# EAGLE design STM32-G0-Dip-Module (EAGLE 9.6.2)
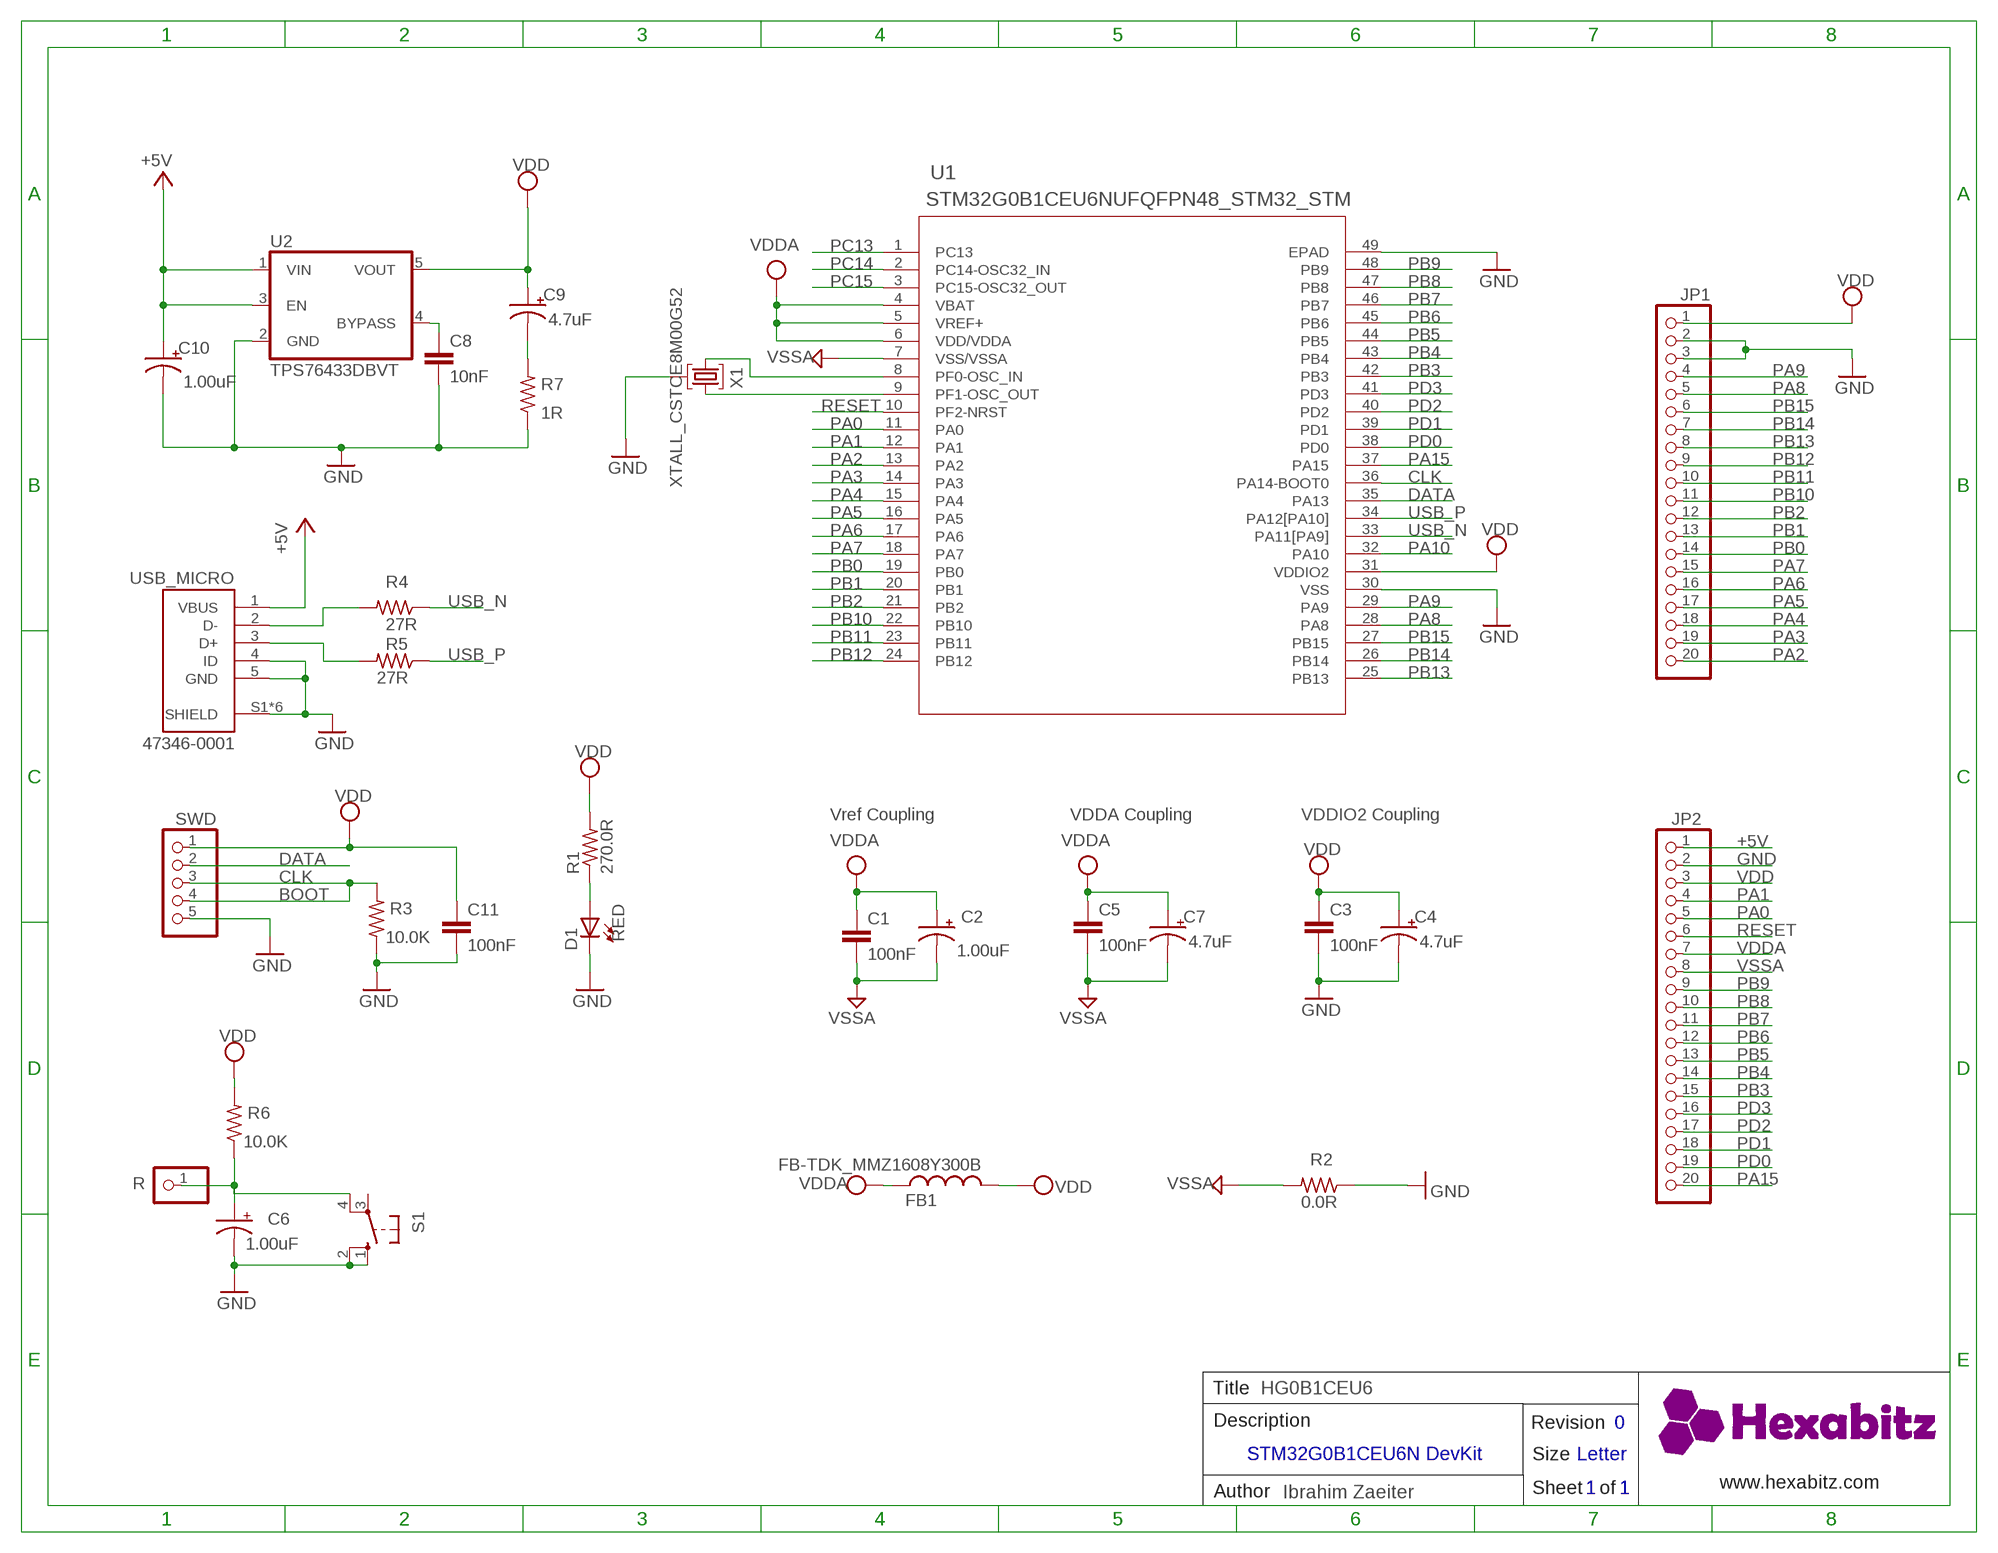
[diagram p0: schematic, sheet 1]

## Parts
C1  100nF  C-0603  [C-0603]
C2  1.00uF  C-0805-POL  [C-0805-POL]
C3  100nF  C-0603  [C-0603]
C4  4.7uF  C-0805-POL  [C-0805-POL]
C5  100nF  C-0603  [C-0603]
C6  1.00uF  C-0805-POL  [C-0805-POL]
C7  4.7uF  C-0805-POL  [C-0805-POL]
C8  10nF  C-0603  [C-0603]
C9  4.7uF  C-0805-POL  [C-0805-POL]
C10  1.00uF  C-0805-POL  [C-0805-POL]
C11  100nF  C-0603  [C-0603]
D1  RED  VLMS1300-GS08  [VLMS1300-GS08]
FB1  FB-TDK_MMZ1608Y300B  [FB-TDK_MMZ1608Y300B]
JP1  PINHD-1X20  [1X20]
JP2  PINHD-1X20  [1X20]
R  PINHD-1X1  [1X01]
R1  270.0R  R-0603  [R-0603]
R2  0.0R  R-0603  [R-0603]
R3  10.0K  R-0603  [R-0603]
R4  27R  R-0603  [R-0603]
R5  27R  R-0603  [R-0603]
R6  10.0K  R-0603  [R-0603]
R7  1R  R-0603  [R-0603]
S1  10-XX  [B3F-10XX]
SWD  PINHD-1X5/90  [1X05/90]
U1  STM32G0B1CEU6NUFQFPN48_STM32_STM  [UFQFPN48_STM32_STM]
U2  TPS76433DBVT  [SOT25]
USB_MICRO  47346-0001  [MOLEX_47346-0001]
X1  XTALL_CSTCE8M00G52  [XTALL_CSTCE8M00G52]

## Nets
+5V: C10.1(+) JP2.1 U2.1(VIN) U2.3(EN) USB_MICRO.1(VBUS)
AGND: C1.2 C2.2(-) C5.2 C7.2(-) JP2.8 R2.2 U1.7(VSS/VSSA) ; supply symbol labelled VSSA
CLK: R3.2 SWD.3 SWD.4 U1.36(PA14-BOOT0)
CRYSTAL_N: U1.8(PF0-OSC_IN) X1.P$1
CRYSTAL_P: U1.9(PF1-OSC_OUT) X1.P$3
D_N [diff pairs]: R4.2 USB_MICRO.2(D-)
D_P [diff pairs]: R5.2 USB_MICRO.3(D+)
DATA: SWD.2 U1.35(PA13)
GND: C3.2 C4.2(-) C6.2(-) C8.2 C10.2(-) C11.2 D1.C JP1.2 JP1.3 JP2.2 R2.1 R3.1 R7.1 S1.1(S) S1.2(S1) SWD.5 U1.30(VSS) U1.49(EPAD) U2.2(GND) USB_MICRO.4(ID) USB_MICRO.5(GND) USB_MICRO.S1(SHIELD) USB_MICRO.S2(SHIELD) USB_MICRO.S3(SHIELD) USB_MICRO.S4(SHIELD) USB_MICRO.S5(SHIELD) USB_MICRO.S6(SHIELD) X1.P$2
N$1: C9.2(-) R7.2
N$4: D1.A R1.1
N$9: C8.1 U2.4(BYPASS)
PA0: JP2.5 U1.11(PA0)
PA1: JP2.4 U1.12(PA1)
PA2: JP1.20 U1.13(PA2)
PA3: JP1.19 U1.14(PA3)
PA4: JP1.18 U1.15(PA4)
PA5: JP1.17 U1.16(PA5)
PA6: JP1.16 U1.17(PA6)
PA7: JP1.15 U1.18(PA7)
PA8: JP1.5 U1.28(PA8)
PA9: JP1.4 U1.29(PA9)
PA10: U1.32(PA10)
PA15: JP2.20 U1.37(PA15)
PB0: JP1.14 U1.19(PB0)
PB1: JP1.13 U1.20(PB1)
PB2: JP1.12 U1.21(PB2)
PB3: JP2.15 U1.42(PB3)
PB4: JP2.14 U1.43(PB4)
PB5: JP2.13 U1.44(PB5)
PB6: JP2.12 U1.45(PB6)
PB7: JP2.11 U1.46(PB7)
PB8: JP2.10 U1.47(PB8)
PB9: JP2.9 U1.48(PB9)
PB10: JP1.11 U1.22(PB10)
PB11: JP1.10 U1.23(PB11)
PB12: JP1.9 U1.24(PB12)
PB13: JP1.8 U1.25(PB13)
PB14: JP1.7 U1.26(PB14)
PB15: JP1.6 U1.27(PB15)
PC13: U1.1(PC13)
PC14: U1.2(PC14-OSC32_IN)
PC15: U1.3(PC15-OSC32_OUT)
PD0: JP2.19 U1.38(PD0)
PD1: JP2.18 U1.39(PD1)
PD2: JP2.17 U1.40(PD2)
PD3: JP2.16 U1.41(PD3)
RESET: C6.1(+) JP2.6 R6.1 R.1 S1.4(P1) U1.10(PF2-NRST)
USB_N [diff pairs]: R4.1 U1.33(PA11[PA9])
USB_P [diff pairs]: R5.1 U1.34(PA12[PA10])
VDD: C3.1 C4.1(+) C9.1(+) C11.1 FB1.2 JP1.1 JP2.3 R1.2 R6.2 SWD.1 U1.31(VDDIO2) U2.5(VOUT)
VDDA: C1.1 C2.1(+) C5.1 C7.1(+) FB1.1 JP2.7 U1.4(VBAT) U1.5(VREF+) U1.6(VDD/VDDA)
Unconnected: S1.3(P)

## Notes on the sheet
- C:/Users/Admin/Desktop/logodraft.bmp
- Vref Coupling | VDDA Coupling | VDDIO2 Coupling
- BOOT
- VSSA
- Title | HG0B1CEU6
- Description | Revision | 0
- STM32G0B1CEU6N DevKit
- Size | Letter
- www.hexabitz.com
- Author | Ibrahim Zaeiter | Sheet   of | 1 | 1

## Library data of the parts
C1 C3 C11 = HEXABITZ_RCLS:C-0603: CAP CER 10% X7R 0603; CAPACITANCE: 100nF; MFN: KEMET; MPN: C0603C104K8RACTU; OCTOPART_URL: https://octopart.com/c0603c104k8ractu-kemet-145075?r=sp&s=9bS9ASSwSEqMCE9KBEQZ0g; TOLERANCE: 10%; VOLTAGE_RATING: 10V
C2 C6 C10 = HEXABITZ_RCLS:C-0805-POL: Cap Tant Solid SMD 2012; CAPACITANCE: 1.00uF; MFN: Yageo; MPN: CC0805KKX7R7BB105; OCTOPART_URL: https://octopart.com/cc0805kkx7r7bb105-yageo-8376555?r=sp&s=YKl1wwtkROau_X5nniH2ig; TOLERANCE: 10%; VOLTAGE_RATING: 16V
C4 C7 C9 = HEXABITZ_RCLS:C-0805-POL: Cap Tant Solid SMD 2012; CAPACITANCE: 4.7uF; MFN: Murata; MPN: GRM21BC81E475KA12L; OCTOPART_URL: https://octopart.com/grm21bc81e475ka12l-murata-10331911?r=sp&s=RY3qZSD8T6mG6TC9CHI5qQ; TOLERANCE: 10%; VOLTAGE_RATING: 25V
C5 C8 = HEXABITZ_RCLS:C-0603: CAP CER 10% X7R 0603; CAPACITANCE: 100nF; MFN: KEMET; MPN: C0603C104K8RACTU; OCTOPART_URL: https://octopart.com/c0603c104k8ractu-kemet-145075?r=sp&s=9bS9ASSwSEqMCE9KBEQZ0g; TOLERANCE: 10%; VOLTAGE_RATING: 10
D1 = HEXABITZ_USER_INTERFACE_PARTS:VLMS1300-GS08: Red 0603 130° Clear 54 mcd 2 V Surface Mount ChipLED ; Octopart Url : http://octopart.com/vlms1300-gs08-vishay-21709201; MFN: Vishay; MPN: VLMS1300-GS08; OCTOPART_URL: https://octopart.com/vlms1300-gs08-vishay-21709201?r=sp&s=_gcP4_q8T1SC6PJQPTQ9yA
FB1 = HEXABITZ_RCLS:FB-TDK_MMZ1608Y300B: Ferrite Beads Multi-Layer 30Ohm 25% 100MHz 1.5A 50mOhm DCR 0603; MFN: TDK; MPN: MMZ1608Y300B; OCTOPART_URL: https://octopart.com/mmz1608y300b-tdk-368280?r=sp&s=cd9_2ZEqQ9q9UNBuQgHAiA
JP1 JP2 = pinhead:PINHD-1X20: PIN HEADER
R = HEXABITZ_USER_INTERFACE_PARTS:PINHD-1X1: PIN HEADER; MFN: TE Connectivity; MPN: 87227-1; OCTOPART_URL: https://octopart.com/87227-1-te+connectivity-39512052?r=sp
R1 = HEXABITZ_RCLS:R-0603: Thick Film Resistors - SMD 0603; MFN: Yageo; MPN: RC0603FR-07270RL; OCTOPART_URL: https://octopart.com/search?q=RC0603FR-07270RL&start=0; RESISTANCE: 270.0 Ohm; TOLERANCE: 1%
R2 = HEXABITZ_RCLS:R-0603: Thick Film Resistors - SMD 0603; MFN: Yageo; MPN: RC0603JR-070RL; OCTOPART_URL: https://octopart.com/rc0603jr-070rl-yageo-1241539?r=sp&s=X2NteqRjRNWrnx42Y0aliA; RESISTANCE: 0.0 Ohm
R3-R7 = HEXABITZ_RCLS:R-0603: Thick Film Resistors - SMD 0603; MFN: Yageo; MPN: RC0603JR-0710KL; OCTOPART_URL: https://octopart.com/search?q=RC0603JR-0710KL&start=0; RESISTANCE: 10.0K Ohm; TOLERANCE: 5%
S1 = switch-omron:10-XX: OMRON SWITCH; MPN: B3F-1000; OC_FARNELL: 176432; OC_NEWARK: 36M3542
SWD = pinhead:PINHD-1X5: PIN HEADER
U1 = HEXABITZ_ICs:STM32G0B1CEU6N; COPYRIGHT: Copyright (C) 2022 Ultra Librarian. All rights reserved.; MFN: STMicroelectronics; MPN: STM32G0B1CEU6N; OCTOPART_URL: https://app.ultralibrarian.com/details/c038d58b-752a-11eb-9033-0a34d6323d74/STMicroelectronics/STM32G0B1CEU6N?uid=116364672
U2 = HEXABITZ_ICs:TPS764: 150mA Low Noise LDO Voltage Regulator with Enable; MFN: Texas Instruments; MPN: TPS76433DBVT; OCTOPART_URL: https://octopart.com/tps76433dbvt-texas+instruments-69873?r=sp&s=0aHKKhMLSUCTmmqJkhwwIQ
USB_MICRO = 47346-0001:47346-0001: USB Connectors MICRO USB B RECPT BTTM MOUNT ASSY Check availability <https://pricing.snapeda.com/parts/47346-0001/Molex/view-part?ref=eda>; AVAILABILITY: In Stock; DESCRIPTION: USB - micro B USB 2.0 Receptacle Connector 5 Position Surface Mount, Right Angle; MF: Molex; MP: 47346-0001; PACKAGE: None; PRICE: None; PURCHASE-URL: https://pricing.snapeda.com/search/part/47346-0001/?ref=eda
X1 = HEXABITZ_OTHER_PARTS:XTALL_CSTCE8M00G52: MURATA CSTCE8M00G52-R0 RESONATOR, SMD, 8MHZ ; Octopart Url : https://octopart.com/cstce8m00g52-r0-murata-7145559; MFN: Murata; MPN: CSTCE8M00G52Z-R0; OCTOPART_URL: https://octopart.com/cstce8m00g52z-r0-murata-17755941?r=sp&s=JDnNJnrHQhyS8Zk4ofFWXw

## Net classes
1 diff pairs: width 0.254 mm, clearance 0.178 mm

## Board
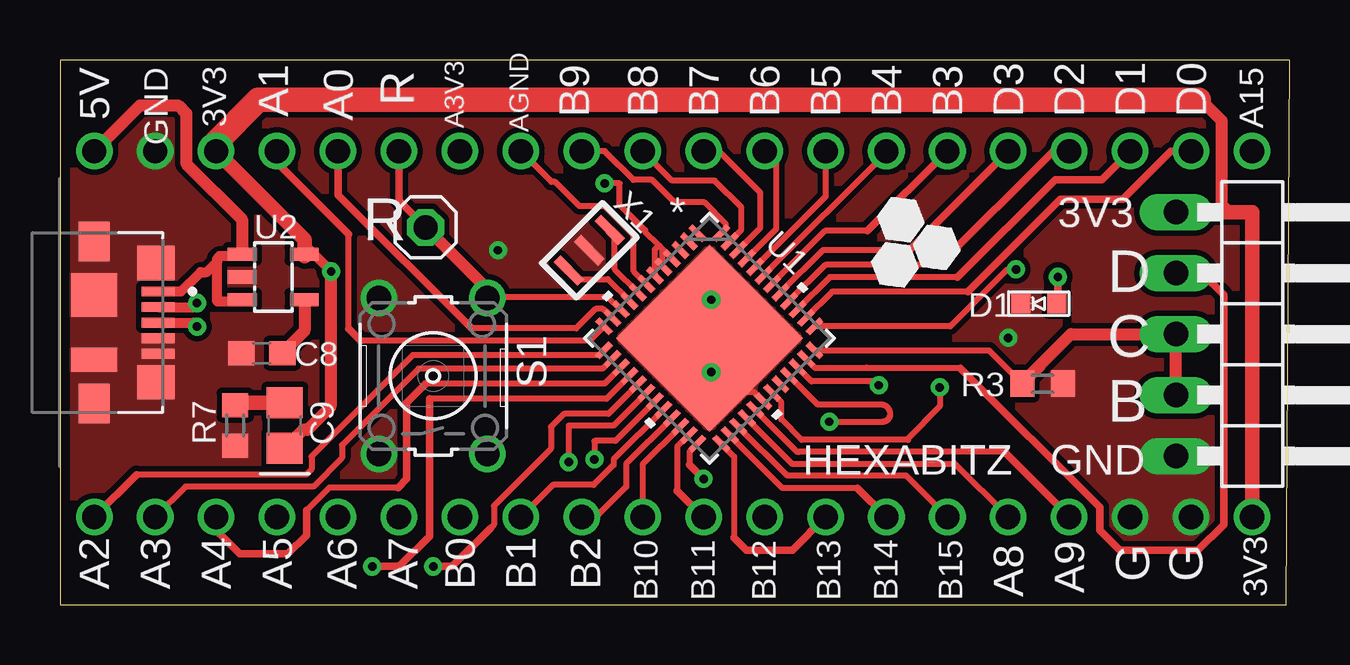
[diagram p1: board, top side]
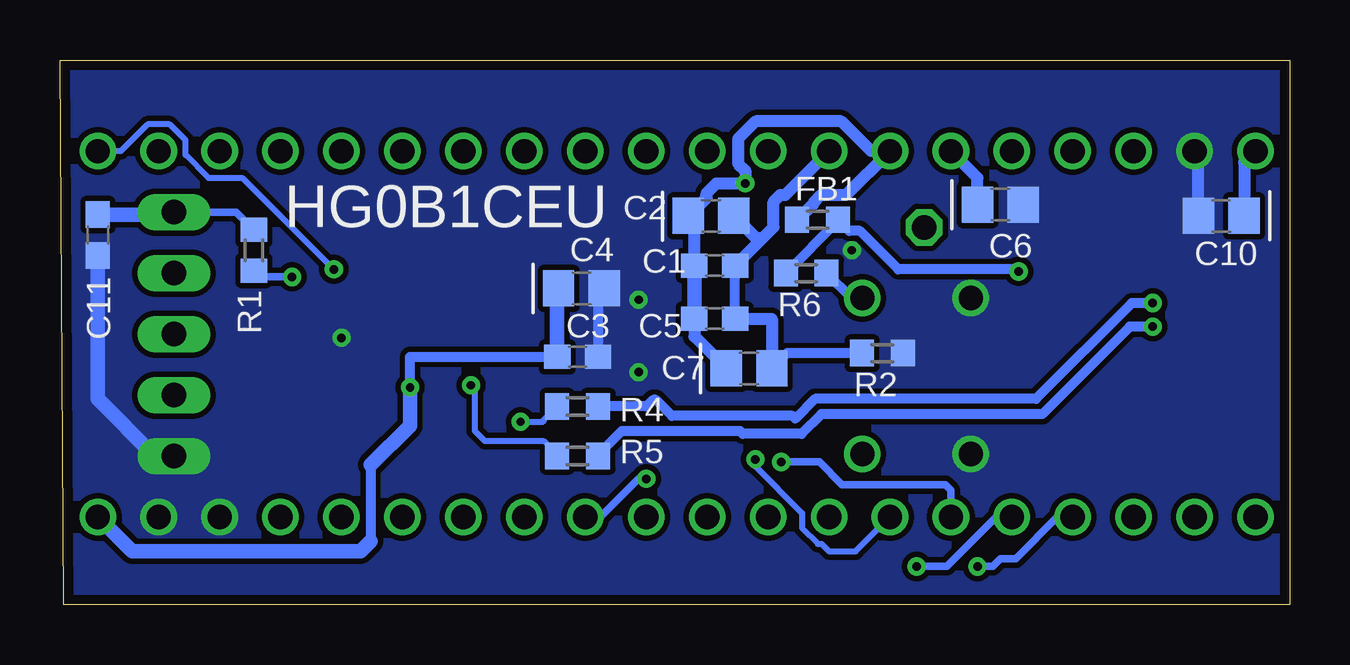
[diagram p2: board, bottom side, seen from below]

Size 51.26 x 22.69 mm. Coordinates in mm from the lower left corner, seen from the top.
Outline: 0,0 51.1,0 51.26,22.69 0,22.69 0,0
Copper layers (1*16): Top 0.035mm / dielectric 1.5mm / Bottom 0.035mm
Design rules "default *": minimum track width 6mil, minimum drill 0.35mm, track to track 9mil, track to pad 9mil, pad to pad 9mil, via to via 9mil, smd to smd 9mil, copper to edge 16mil, drill to drill 6mil, minimum pad ring 10mil, minimum via ring 8mil, stop-mask expansion 4mil, vias tented up to drill 0mil, thermal gap 10mil

### Footprints (pad centres in the part's own frame; a part is rotated, then mirrored left to right if it is on the bottom)
C-0603 = smd 1.1 x 1: 1 -0.85,0; 2 0.85,0
C-0805-POL = smd 1.3 x 1.5: 1 -0.95,0; 2 0.95,0
VLMS1300-GS08 = smd 0.8 x 0.8: A 0,0.75; C 0,-0.75
FB-TDK_MMZ1608Y300B = smd 1 x 1.1: 1 -0.85,0; 2 0.85,0
1X20 = drill 1.016: 1 -24.13,0; 2 -21.59,0; 3 -19.05,0; 4 -16.51,0; 5 -13.97,0; 6 -11.43,0; 7 -8.89,0; 8 -6.35,0; 9 -3.81,0; 10 -1.27,0; 11 1.27,0; 12 3.81,0; 13 6.35,0; 14 8.89,0; 15 11.43,0; 16 13.97,0; 17 16.51,0; 18 19.05,0; 19 21.59,0; 20 24.13,0
1X01 = drill 1.016 octagon: 1 0,0
R-0603 = smd 1 x 1.1: 1 -0.85,0; 2 0.85,0
B3F-10XX = drill 1.016: 1 -3.251,2.261; 2 3.251,2.261; 3 -3.251,-2.261; 4 3.251,-2.261
1X05/90 = drill 1.016 long: 1 -5.08,-3.81; 2 -2.54,-3.81; 3 0,-3.81; 4 2.54,-3.81; 5 5.08,-3.81
UFQFPN48_STM32_STM = smd 0.813 x 0.254: 1 -3.454,2.751; 2 -3.454,2.251; 3 -3.454,1.75; 4 -3.454,1.25; 5 -3.454,0.75; 6 -3.454,0.25; 7 -3.454,-0.25; 8 -3.454,-0.75; 9 -3.454,-1.25; 10 -3.454,-1.75; 11 -3.454,-2.251; 12 -3.454,-2.751; 25 3.454,-2.751; 26 3.454,-2.251; 27 3.454,-1.75; 28 3.454,-1.25; 29 3.454,-0.75; 30 3.454,-0.25; 31 3.454,0.25; 32 3.454,0.75; 33 3.454,1.25; 34 3.454,1.75; 35 3.454,2.251; 36 3.454,2.751 | smd 0.254 x 0.813: 13 -2.751,-3.454; 14 -2.251,-3.454; 15 -1.75,-3.454; 16 -1.25,-3.454; 17 -0.75,-3.454; 18 -0.25,-3.454; 19 0.25,-3.454; 20 0.75,-3.454; 21 1.25,-3.454; 22 1.75,-3.454; 23 2.251,-3.454; 24 2.751,-3.454; 37 2.751,3.454; 38 2.251,3.454; 39 1.75,3.454; 40 1.25,3.454; 41 0.75,3.454; 42 0.25,3.454; 43 -0.25,3.454; 44 -0.75,3.454; 45 -1.25,3.454; 46 -1.75,3.454; 47 -2.251,3.454; 48 -2.751,3.454 | smd 5.512 x 5.512: 49 0,0
SOT25 = smd 0.55 x 1.2: 1 -0.95,-1.3; 2 0,-1.3; 3 0.95,-1.3; 4 0.95,1.3; 5 -0.95,1.3
MOLEX_47346-0001 = smd 0.406 x 1.38: 1 -1.3,2.66; 2 -0.65,2.66; 3 0,2.66; 4 0.65,2.66; 5 1.3,2.66 | smd 1.425 x 1.55: S1 -2.487,2.575; S2 2.487,2.575 | smd 1.65 x 1.3: S3 -3.375,0; S6 3.375,0 | smd 1.8 x 1.9: S4 -1.15,0 | smd 1 x 1.9: S5 1.55,0
XTALL_CSTCE8M00G52 = smd 1.4 x 0.4: P$1 0,1.2; P$2 0,0; P$3 0,-1.2

### Placement (x,y rotation side)
C1  23.97,14.13 0 bottom
C2  24.13,16.19 0 bottom
C3  29.69,10.32 0 bottom
C4  29.53,13.18 0 bottom
C5  23.97,11.91 0 bottom
C6  12.06,16.67 0 bottom
C7  22.54,9.84 0 bottom
C8  8.41,10.48 180 top
C9  9.37,7.46 90 top
C10  2.86,16.19 180 bottom
C11  49.69,15.4 270 bottom
D1  40.8,12.54 270 top
FB1  19.69,16.03 0 bottom
JP1  25.56,3.65 0 bottom
JP2  25.56,18.89 0 top
R  15.24,15.72 0 top
R1  43.18,14.76 90 bottom
R2  16.99,10.48 180 bottom
R3  40.96,9.21 180 top
R4  29.69,8.26 0 bottom
R5  29.69,6.19 0 bottom
R6  20.16,13.81 180 bottom
R7  7.3,7.46 90 top
S1  15.56,9.53 90 top
SWD  50.32,11.27 270 top
U1  27.06,11.09 315 top
U2  8.89,13.65 270 top
USB_MICRO  1.43,11.75 270 top
X1  22.07,14.76 315 top

### Tracks (layer width: path | path; a pad name or v marks a point on that pad's centre or on a via)
+5V
  Top 0.406: 6.56,14.29 6.56,12.63 7.52,12.63 U2.3 | 6.56,14.29 6.56,14.42 6.65,14.52 7.51,14.52 U2.1 | USB_MICRO.1 5.05,13.05 5.86,13.85 6.12,13.85 6.56,14.29
  Top 0.508: JP2.1 3.33,20.8 4.92,20.8 5.26,20.45 5.26,18.38 7.59,16.05 U2.1
  Bottom 0.508: JP2.1 1.91,18.41 C10.1
AGND
  Top 0.254: U1.7 23.91,13.9 23.91,15.41 22.71,16.6 21.65,16.6 20.64,17.62 20.48,17.62 JP2.8
  Bottom 0.406: C5.2 C1.2 | R2.2 20.96,10.48 C7.2
  Bottom 0.508: C5.2 21.59,11.91 C7.2 | C1.2 21.96,15.29 | 21.96,15.29 21.52,15.73 21.52,16.78 21.23,17.07 21.03,17.07 JP2.8 | C2.2 22.28,15.29 21.96,15.29
CLK
  Top 0.254: U1.36 38.72,10.6 R3.2
  Top 0.305: SWD.4 46.51,8.89
  Top 0.508: 46.51,8.89 SWD.3 42.14,11.27 40.82,9.96 40.82,9.92 R3.2
CRYSTAL_N
  Top 0.254: X1.P$1 23.11,15.41 23.11,13.98 U1.8 | U1.8
CRYSTAL_P
  Top 0.254: X1.P$3 21.57,13.56 22.83,13.56 U1.9 | X1.P$3 | U1.9
D_N  (via drill 0.35)
  Top 0.406: USB_MICRO.2 5.59,12.4 5.71,12.52 v5.71,12.56
  Bottom 0.406: v5.71,12.56 6.59,12.56 10.58,8.57 19.79,8.57 20.61,7.75 20.72,7.86 25.76,7.86 26.43,8.53 26.54,8.53 26.82,8.26 R4.2
D_P  (via drill 0.35)
  Top 0.406: USB_MICRO.3 5.59,11.75 5.71,11.62 v5.71,11.58
  Bottom 0.406: v5.71,11.58 6.68,11.58 10.32,7.94 19.53,7.94 20.35,7.12 22.8,7.12 22.91,7.23 26.37,7.23 26.38,7.22 27.85,7.22 28.84,6.24 R5.2
DATA
  Top 0.254: U1.35 31.48,9.86 33.61,9.86 33.62,9.88 37.51,9.88 37.54,9.85
  Top 0.305: SWD.2 47.59,13.81 48.5,12.9 48.5,3.34 47.43,2.27 44.17,2.27 43.34,3.1 43.34,4.05 37.54,9.85
GND  (via drill 0.35)
  Top 0.254: v27.15,9.68 27.98,8.85 28.93,8.85 29.31,8.47 U1.30
  Top 0.305: 4.13,14.24 USB_MICRO.S1
  Bottom 0.406: C4.2 28.84,12.92 C3.2
  Bottom 0.508: C10.2 3.81,18.73 JP2.2
  Bottom 0.61: SWD.5 47.31,6.19 49.69,8.57 C11.2
  other vias: 27.15,12.7 39.53,11.11 18.26,14.76
  pour Bottom (no thermals): -0.23,22.7 51.12,22.7 51.12,0.16 -0.23,0.16
  pour Top (no thermals): -0.16,22.7 51.12,22.7 51.12,0 -0.16,0
N$1
  Top 0.61: R7.2 7.4,8.41 C9.2
N$4  (via drill 0.35)
  Top 0.305: v41.59,13.65 41.59,12.59 D1.A
  Bottom 0.305: R1.1 42.92,13.65 v41.59,13.65
N$9
  Top 0.508: U2.4 10.19,11.4 C8.1
PA0
  Top 0.254: 17.15,11.51 21.52,11.51 22.33,12.32 22.63,12.32 23.01,11.94 U1.11
  Top 0.305: 17.15,11.51 11.59,17.07 JP2.5
PA1
  Top 0.254: U1.12 22.08,10.99 12.53,10.99 | 12.04,11.49 12.04,15.43
  Top 0.305: 12.53,10.99 12.04,11.49 | 12.04,15.43 9.05,18.42 JP2.4
PA2
  Top 0.254: U1.13 22.48,10.4 14.7,10.4 10.48,6.18 10.48,5.64 10.26,5.42 3.2,5.42 | U1.13
  Top 0.305: 3.2,5.42 JP1.20
PA3
  Top 0.254: U1.14 22.62,9.83 14.94,9.83 11.76,6.65 11.76,6.11 10.57,4.92 5.23,4.92 JP1.19 | U1.14
PA4
  Top 0.254: 14.08,4.88 11.23,4.88 10.27,3.92 | 15.24,9.21 22.7,9.21 U1.15 | U1.15
  Top 0.305: 14.08,4.88 14.45,5.24 14.45,8.41 15.24,9.21 | 10.27,3.92 10.27,2.89 9.49,2.11 7.5,2.11 6.51,3.1 JP1.18
PA5  (via drill 0.35)
  Top 0.254: U1.16 22.78,8.57 15.4,8.57
  Top 0.305: 15.4,8.57 15.4,2.86 14.13,1.59 v13.02,1.59
  Bottom 0.305: v13.02,1.59 12.38,1.59 12.06,1.91 11.43,1.91 9.68,3.65 JP1.17
PA6  (via drill 0.35)
  Top 0.254: U1.17 | 17.94,3.17 18.09,3.33 18.09,4.11 20.47,6.49 20.47,7.41 21,7.94 22.85,7.94 U1.17
  Top 0.305: 17.94,3.17 16.35,1.59 v15.56,1.59
  Bottom 0.305: v15.56,1.59 14.29,1.59 12.22,3.65 JP1.16
PA7  (via drill 0.35)
  Top 0.254: U1.18 23.08,7.46 21.2,7.46 v21.2,5.94
  Bottom 0.305: v21.2,5.94 19.61,5.94 18.66,4.99 14.36,4.99 14.13,4.76 JP1.15
PA8
  Top 0.254: JP1.5 37.32,5.86 30.53,5.86 U1.28 | U1.28
PA9
  Top 0.254: 39.36,6.36 30.81,6.36 30.8,6.35 30.75,6.35 U1.29
  Top 0.305: JP1.4 39.36,6.36
PA15  (via drill 0.35)
  Top 0.254: U1.37 37.11,11.59 39.49,13.97 v39.85,13.97
  Bottom 0.254: v39.85,13.97 43.65,17.77 45.07,17.77 46.03,18.73 46.03,19.35 46.69,20.01 47.61,20.01 48.73,18.89 JP2.20
PB0  (via drill 0.35)
  Top 0.254: U1.19 23.15,6.83 22.28,6.83 v22.28,6.05
  Bottom 0.254: v22.28,6.05 22.28,5.76 20.33,3.81 20.33,3.19 19.67,2.53 19.52,2.53 19.21,2.22 18.1,2.22 JP1.14
PB1
  Top 0.254: U1.20 23.08,6.05 23.08,5.82 22.25,4.98 20.54,4.98 JP1.13 | U1.20
PB2
  Top 0.254: U1.21 23.6,5.86 23.6,4.91 22.34,3.65 JP1.12
PB3
  Top 0.254: 33.66,15.57 31.89,15.57 U1.42 | U1.42
  Top 0.305: JP2.15 33.66,15.57
PB4
  Top 0.254: 34.45,18.83 U1.43 | U1.43
  Top 0.305: JP2.14 34.45,18.83
PB5
  Top 0.254: JP2.13 31.91,17 U1.44 | U1.44
PB6
  Top 0.254: JP2.12 29.84,18.42 29.84,15.64 U1.45 | U1.45
PB7
  Top 0.254: JP2.11 27.46,18.89 29.18,17.18 29.18,15.68 U1.46 | U1.46
PB8
  Top 0.254: U1.47 28.4,15.61 28.4,16.55 27.29,17.67 25.51,17.67 JP2.10 | U1.47
PB9
  Top 0.254: U1.48 27.76,15.68 27.76,15.86 26.86,16.76 25.62,16.76 24.68,17.69 23.9,17.69 22.7,18.89 JP2.9 | U1.48
PB10
  Top 0.254: U1.22 24.29,5.84 JP1.11 | U1.22
PB11
  Top 0.254: U1.23 25.73,6.57 25.73,4.75 | U1.23
  Top 0.305: 25.73,4.75 JP1.10
PB12  (via drill 0.35)
  Top 0.254: U1.24 26.25,6.39 26.25,5.82
  Top 0.305: 26.25,5.82 v26.83,5.24
  Bottom 0.305: v26.83,5.24 27.15,5.24 28.73,3.65 JP1.9
PB13
  Top 0.254: U1.25 28.1,6.17 28.1,2.78
  Top 0.305: 28.1,2.78 28.61,2.27 30.52,2.27 JP1.8
PB14
  Top 0.254: 33.25,4.85 30.12,4.85 U1.26 | U1.26
  Top 0.305: JP1.7 33.25,4.85
PB15
  Top 0.254: JP1.6 35.27,5.37 30.31,5.37 U1.27
PD0
  Top 0.254: 37.85,13.04 32.2,13.04 U1.38 | U1.38
  Top 0.305: JP2.19 46.29,18.89 44.3,16.9 41.7,16.9 37.85,13.04
PD1
  Top 0.254: 37.41,13.64 32.09,13.64 U1.39 | U1.39
  Top 0.305: JP2.18 43.43,17.71 41.48,17.71 37.41,13.64
PD2
  Top 0.254: 36.66,14.16 31.9,14.16 U1.40 | U1.40
  Top 0.305: JP2.17 41.4,18.89 36.66,14.16
PD3
  Top 0.254: 35.41,14.77 31.8,14.77 U1.41 | U1.41
  Top 0.305: JP2.16 35.41,14.77
RESET
  Top 0.254: U1.10 23.36,12.3 22.85,12.81 17.85,12.81 S1.4
  Top 0.305: JP2.6 14.13,16.83 R.1
  Top 0.508: S1.4 17.82,13.14 R.1
  Bottom 0.406: R6.1 18.28,12.78 S1.4
  Bottom 0.508: C6.1 13.01,17.78 JP2.6
USB_N  (via drill 0.35)
  Top 0.254: U1.33 31.59,8.33 34.21,8.33 arc-90 34.61,7.94 arc-90 34.29,7.62 v32.07,7.62
  Bottom 0.254: v32.07,7.62 31.11,7.62 31.11,7.68 R4.1
USB_P  (via drill 0.35)
  Top 0.254: v34.13,9.14 33.97,9.3 31.33,9.3 U1.34
  Bottom 0.254: v34.13,9.14 33.97,8.98 33.97,7.24 33.56,6.83 31.11,6.83 30.54,6.25 R5.1
VDD  (via drill 0.35)
  Top 0.254: v36.67,9.05 36.67,8.26 35.31,6.9 35.35,6.86 30.91,6.86 30.06,7.72 30.06,8.45 U1.31
  Top 0.406: v11.3,13.88 10.19,14.99 | 10.19,14.52 U2.5
  Top 0.508: 48.74,16.35 48.42,16.67 48.42,20.16 47.55,21.02 47.47,21.02 | v11.3,13.88 11.27,13.85 11.27,8.24 10.32,7.28 10.13,7.28 C9.1
  Top 0.61: JP1.1 49.69,16.35 48.74,16.35 SWD.1 | JP2.3 10.19,15.21 10.19,14.99 10.19,14.52
  Top 1.016: JP2.3 6.51,19.26 8.27,21.02 47.47,21.02
  Bottom 0.305: R1.2 43.92,16.35 46.35,16.35 SWD.1
  Bottom 0.406: v36.67,9.05 36.67,10.32 C3.1 | 38.31,5.82 38.31,2.65 | v11.3,13.88 11.39,13.97 16.32,13.97 17.92,15.57 18.37,15.57 FB1.2 18.83,15.99 R6.2
  Bottom 0.61: C11.1 46.46,16.25 46.35,16.35 | 38.31,2.65 38.73,2.22 48.26,2.22 JP1.1 | v36.67,9.05 36.67,7.46 38.31,5.82 | C3.1 30.54,13.12 C4.1
VDDA  (via drill 0.35)
  Top 0.254: v22.7,17.55 23.33,17.55 23.33,16.67 24.39,15.61 24.39,15.54 24.96,14.96 | U1.4 25.12,14.8 | 25.12,14.8 24.96,14.96 | U1.6 24.8,14.8 24.96,14.96 | U1.5 25.12,14.1 25.12,14.8
  Bottom 0.508: C5.1 24.82,11.17 C7.1 | FB1.1 19.82,16.75 19.82,16.78 19.53,17.07 18.49,17.07 JP2.7 17.45,18.89 18.69,20.14 22.26,20.14 22.99,19.41 22.99,18.38 22.7,18.08 v22.7,17.55 23.91,17.55 24.31,17.14 24.31,16.96 C2.1 24.82,15.93 C1.1
  Bottom 0.61: C5.1 C1.1

### Text on the board
tPlace: 5V | GND | R | 3V3 | A1 | A0 | A3V3 | AGND | B9 | B8 | B7 | B6 | B5 | B4 | B3 | D3 | D2 | D1 | D0 | A15 | * | 3V3 | D | C | B | HEXABITZ | GND | G | G | A2 | A3 | A4 | A5 | A6 | A7 | B0 | B1 | B2 | B10 | B11 | B12 | B13 | B14 | B15 | A8 | A9 | 3V3
bNames: HG0B1CEU